# EAGLE design MD2017_Drive (EAGLE 6.2)
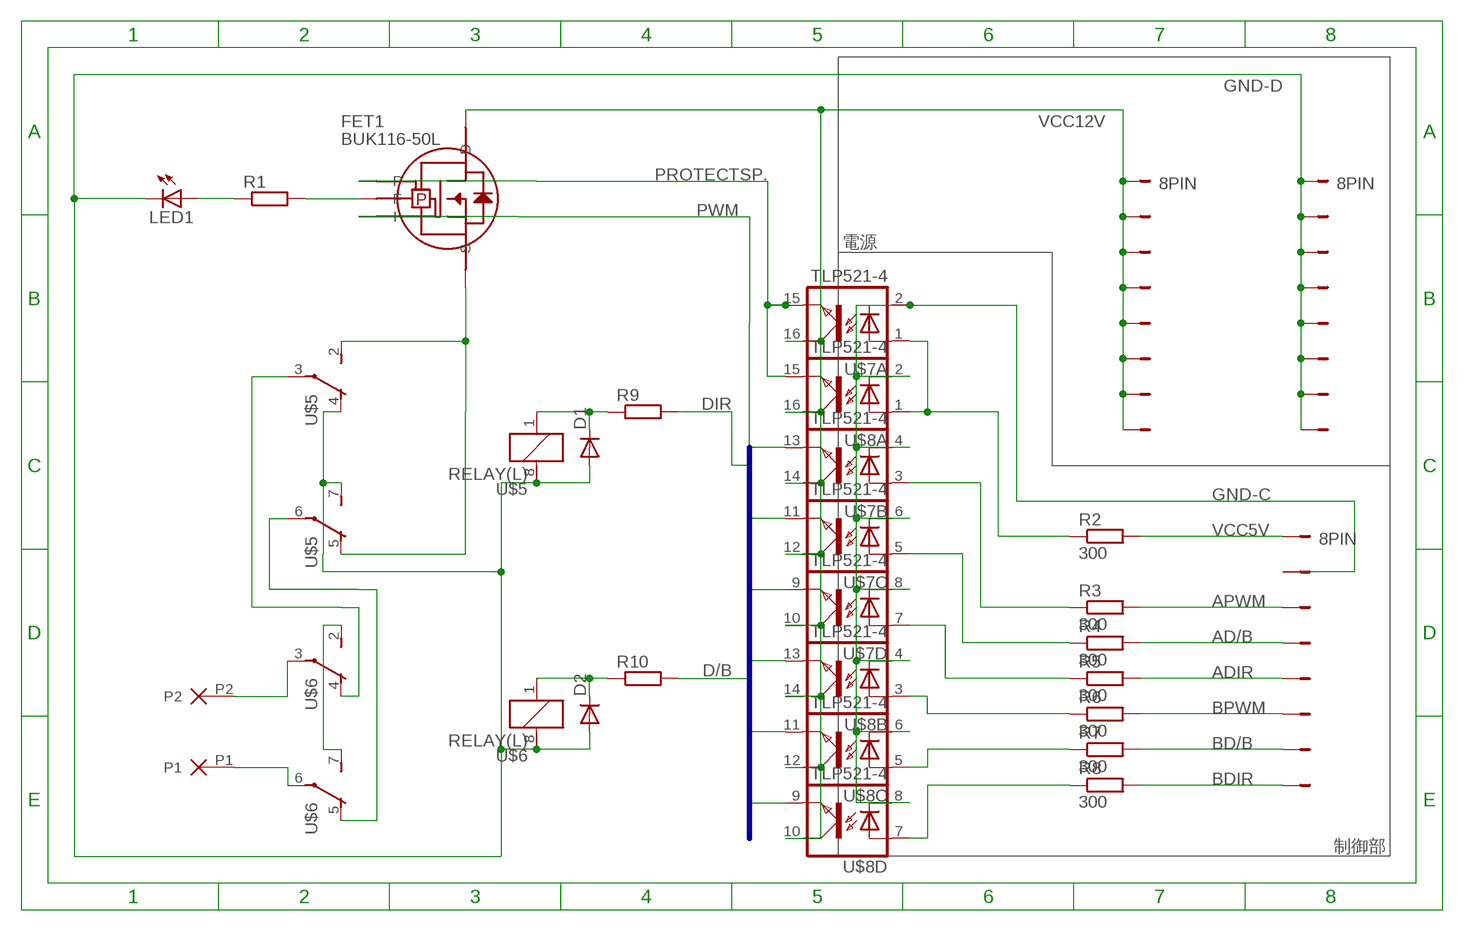
[diagram p0: schematic, sheet 1]

## Parts
D1  DIODE7.5  [DIODE7.5]
D2  DIODE7.5  [DIODE7.5]
FET1  BUK116-50L  [BUK116-50L]
LED1  LED5MM  [LED5MM]
POWERNPORT  8PIN  [FH105-1X8SG]
POWERPPORT  8PIN  [FH105-1X8SG]
R1  R-EU_R3216W  [R3216W]
R2  300  R-EU_R3216W  [R3216W]
R3  300  R-EU_R3216W  [R3216W]
R4  300  R-EU_R3216W  [R3216W]
R5  300  R-EU_R3216W  [R3216W]
R6  300  R-EU_R3216W  [R3216W]
R7  300  R-EU_R3216W  [R3216W]
R8  300  R-EU_R3216W  [R3216W]
R9  R-EU_R3216W  [R3216W]
R10  R-EU_R3216W  [R3216W]
SIGNALPORT  8PIN  [FH105-1X8SG]
U$5  RELAY(L)  [G2R2]
U$6  RELAY(L)  [G2R2]
U$7  TLP521-4  [16PIN]
U$8  TLP521-4  [16PIN]
U$9  2P  [2P]

## Nets
AD/B: R4.2 SIGNALPORT.4
ADIR: R5.2 SIGNALPORT.5
APWM: R3.2 SIGNALPORT.3
BD/B: R7.2 SIGNALPORT.7
BDIR: R8.2 SIGNALPORT.8
BPWM: R6.2 SIGNALPORT.6
BRAKES: U$6.2(R2:S) U$6.7(R1:S)
D/B: R10.2 U$7.11(C:EMIT) U$8.11(C:EMIT)
DIR: R9.2 U$7.9(D:EMIT) U$8.9(D:EMIT)
DIRN: U$5.6(R1:P) U$6.5(R1:O)
DIRP: U$5.3(R2:P) U$6.4(R2:O)
GND-C: SIGNALPORT.2 U$7.2(A:C) U$7.4(B:C) U$7.6(C:C) U$7.8(D:C) U$8.2(A:C) U$8.4(B:C) U$8.6(C:C) U$8.8(D:C)
GND-D: D1.PA(A) D2.PA(A) LED1.K(C) POWERNPORT.1 POWERNPORT.2 POWERNPORT.3 POWERNPORT.4 POWERNPORT.5 POWERNPORT.6 POWERNPORT.7 POWERNPORT.8 U$5.4(R2:O) U$5.7(R1:S) U$5.8 U$6.8
N$7: FET1.2(F) R1.2
N$8: LED1.A R1.1
NCSUPP1: R2.1 U$7.1(A:A) U$8.1(A:A)
NDSUPP1: D1.PK(C) R9.1 U$5.1
NDSUPP2: D2.PK(C) R10.1 U$6.1
NSIG1: R3.1 U$7.3(B:A)
NSIG2: R4.1 U$7.5(C:A)
NSIG3: R5.1 U$7.7(D:A)
NSIG4: R6.1 U$8.3(B:A)
NSIG5: R7.1 U$8.5(C:A)
NSIG6: R8.1 U$8.7(D:A)
OUTN: U$6.6(R1:P) U$9.P1
OUTP: U$6.3(R2:P) U$9.P2
PROTECTSP.: FET1.4(P) U$7.15(A:EMIT) U$8.15(A:EMIT)
PWM: FET1.1(I) U$7.13(B:EMIT) U$8.13(B:EMIT)
PWMOUT: FET1.5(S) U$5.2(R2:S) U$5.5(R1:O)
VCC5V: R2.2 SIGNALPORT.1
VCC12V: FET1.3(D) POWERPPORT.1 POWERPPORT.2 POWERPPORT.3 POWERPPORT.4 POWERPPORT.5 POWERPPORT.6 POWERPPORT.7 POWERPPORT.8 U$7.10(D:COL) U$7.12(C:COL) U$7.14(B:COL) U$7.16(A:COL) U$8.10(D:COL) U$8.12(C:COL) U$8.14(B:COL) U$8.16(A:COL)

## Buses
B$1

## Notes on the sheet
- 電源
- 制御部

## Library data of the parts
D1 D2 = diode:DIODE7.5
FET1 = BUK116-50L:BUK116-50L
LED1 = FP-21T for MITS:LED: LED OSRAM: - CHIPLED LG R971, LG N971, LY N971, LG Q971, LY Q971, LO R971, LY R971 LH N974, LH R974 LS Q976, LO Q976, LY Q976 LO Q996 - Hyper CHIPLED LW Q18S LB Q993, LB Q99A, LB R99A - SideLED LS A670, LO A670, LY A670, LG A670, LP A670 LB A673, LV A673, LT A673, LW A673 LH A674 LY A675 LS A676, LA A676, LO A676, LY A676, LW A676 LS A679, LY A679, LG A679 - Hyper Micro SIDELED® LS Y876, LA Y876, LO Y876, LY Y876 LT Y87S - SmartLED LW L88C, LW L88S LB L89C, LB L89S, LG L890 LS L89K, LO L89K, LY L89K LS L896, LA L896, LO L896, LY L896 - TOPLED LS T670, LO T670, LY T670, LG T670, LP T670 LSG T670, LSP T670, LSY T670, LOP T670, LYG T670 LG T671, LOG T671, LSG T671 LB T673, LV T673, LT T673, LW T673 LH T674 LS T676, LA T676, LO T676, LY T676, LB T676, LH T676, LSB T676, LW T676 LB T67C, LV T67C, LT T67C, LS T67K, LO T67K, LY T67K, LW E67C LS E67B, LA E67B, LO E67B, LY E67B, LB E67C, LV E67C, LT E67C LW T67C LS T679, LY T679, LG T679 LS T770, LO T770, LY T770, LG T770, LP T770 LB T773, LV T773, LT T773, LW T773 LH T774 LS E675, LA E675, LY E675, LS T675 LS T776, LA T776, LO T776, LY T776, LB T776 LHGB T686 LT T68C, LB T68C - Hyper Mini TOPLED® LB M676 - Mini TOPLED Santana® LG M470 LS M47K, LO M47K, LY M47K Source: http://www.osram.convergy.de - LUMILED® LXK2-PW12-R00, LXK2-PW12-S00, LXK2-PW14-U00, LXK2-PW14-V00 LXK2-PM12-R00, LXK2-PM12-S00, LXK2-PM14-U00 LXK2-PE12-Q00, LXK2-PE12-R00, LXK2-PE12-S00, LXK2-PE14-T00, LXK2-PE14-U00 LXK2-PB12-K00, LXK2-PB12-L00, LXK2-PB12-M00, LXK2-PB14-N00, LXK2-PB14-P00, LXK2-PB14-Q00 LXK2-PR12-L00, LXK2-PR12-M00, LXK2-PR14-Q00, LXK2-PR14-R00 LXK2-PD12-Q00, LXK2-PD12-R00, LXK2-PD12-S00 LXK2-PH12-R00, LXK2-PH12-S00 LXK2-PL12-P00, LXK2-PL12-Q00, LXK2-PL12-R00 Source: www.luxeon.com
POWERNPORT POWERPPORT SIGNALPORT = FH105:8PIN
R1-R10 = rcl:R-EU_: RESISTOR, European symbol
U$5 U$6 = relay:RELAY(L)
U$7 U$8 = photocoupler:TLP521-4
U$9 = Powerio:2P

## Board
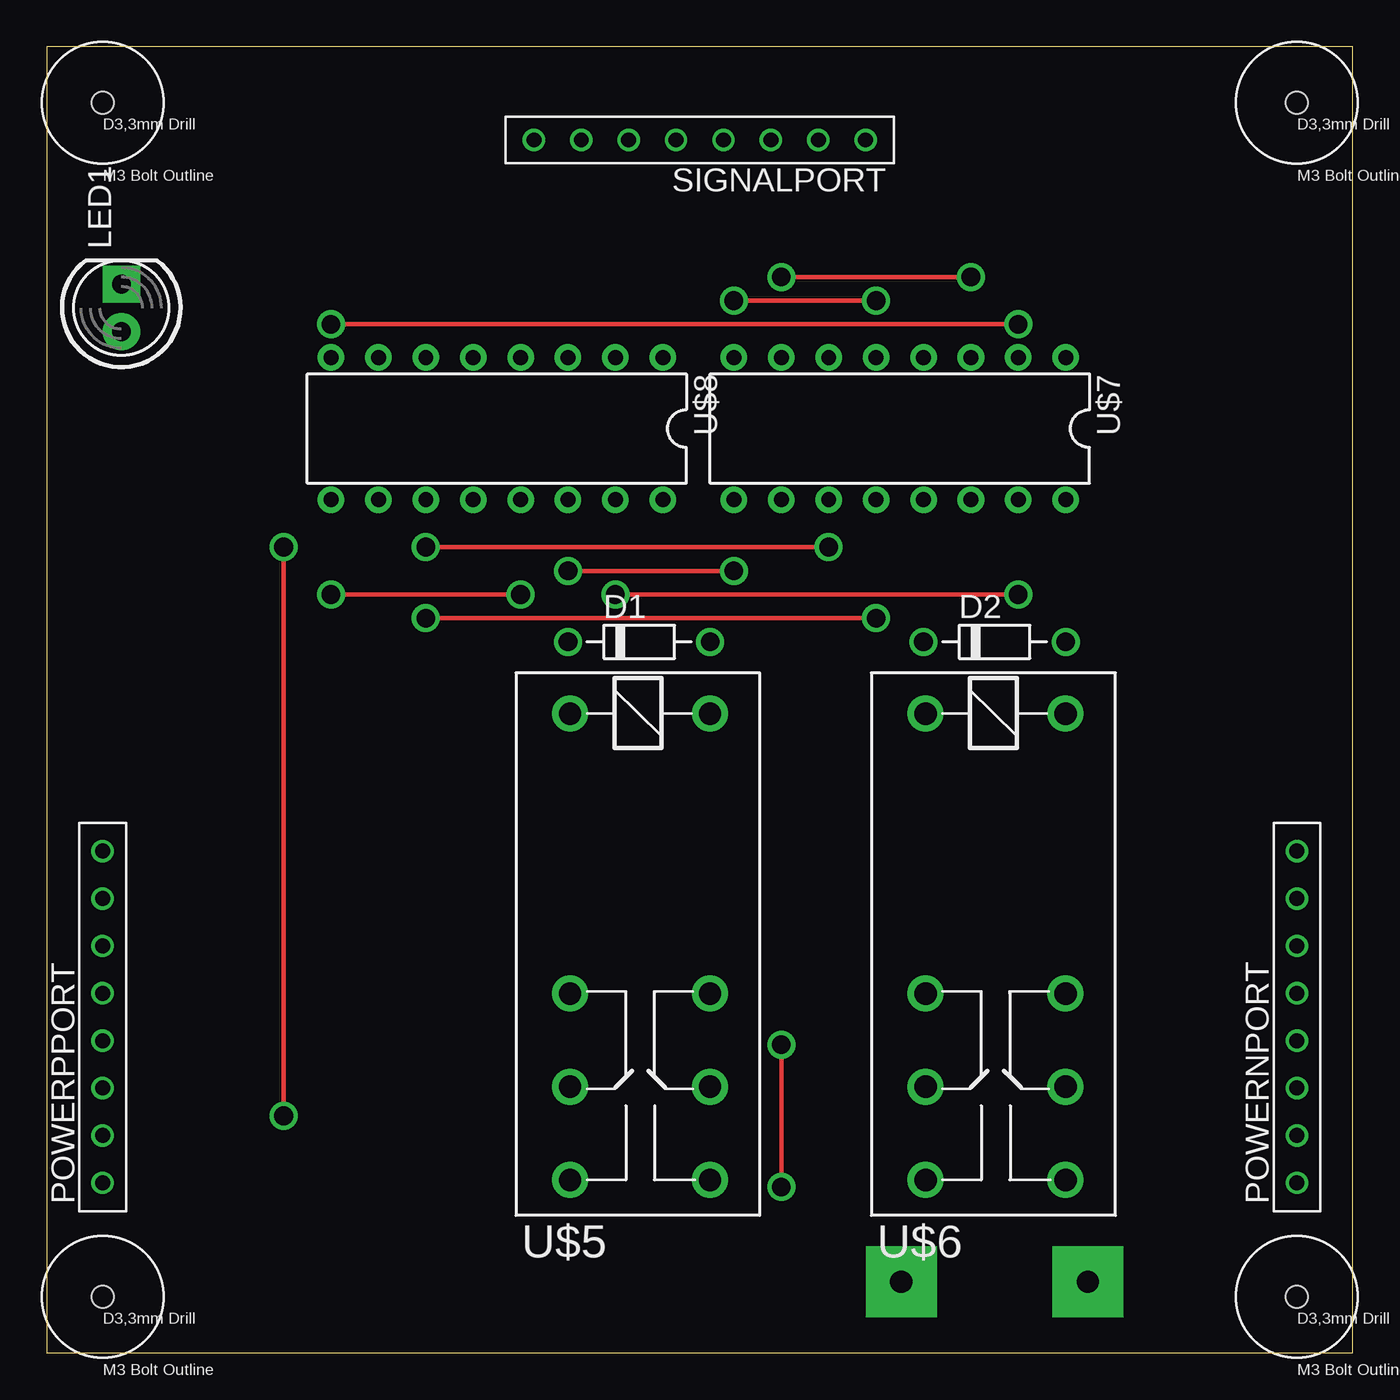
[diagram p1: board, top side]
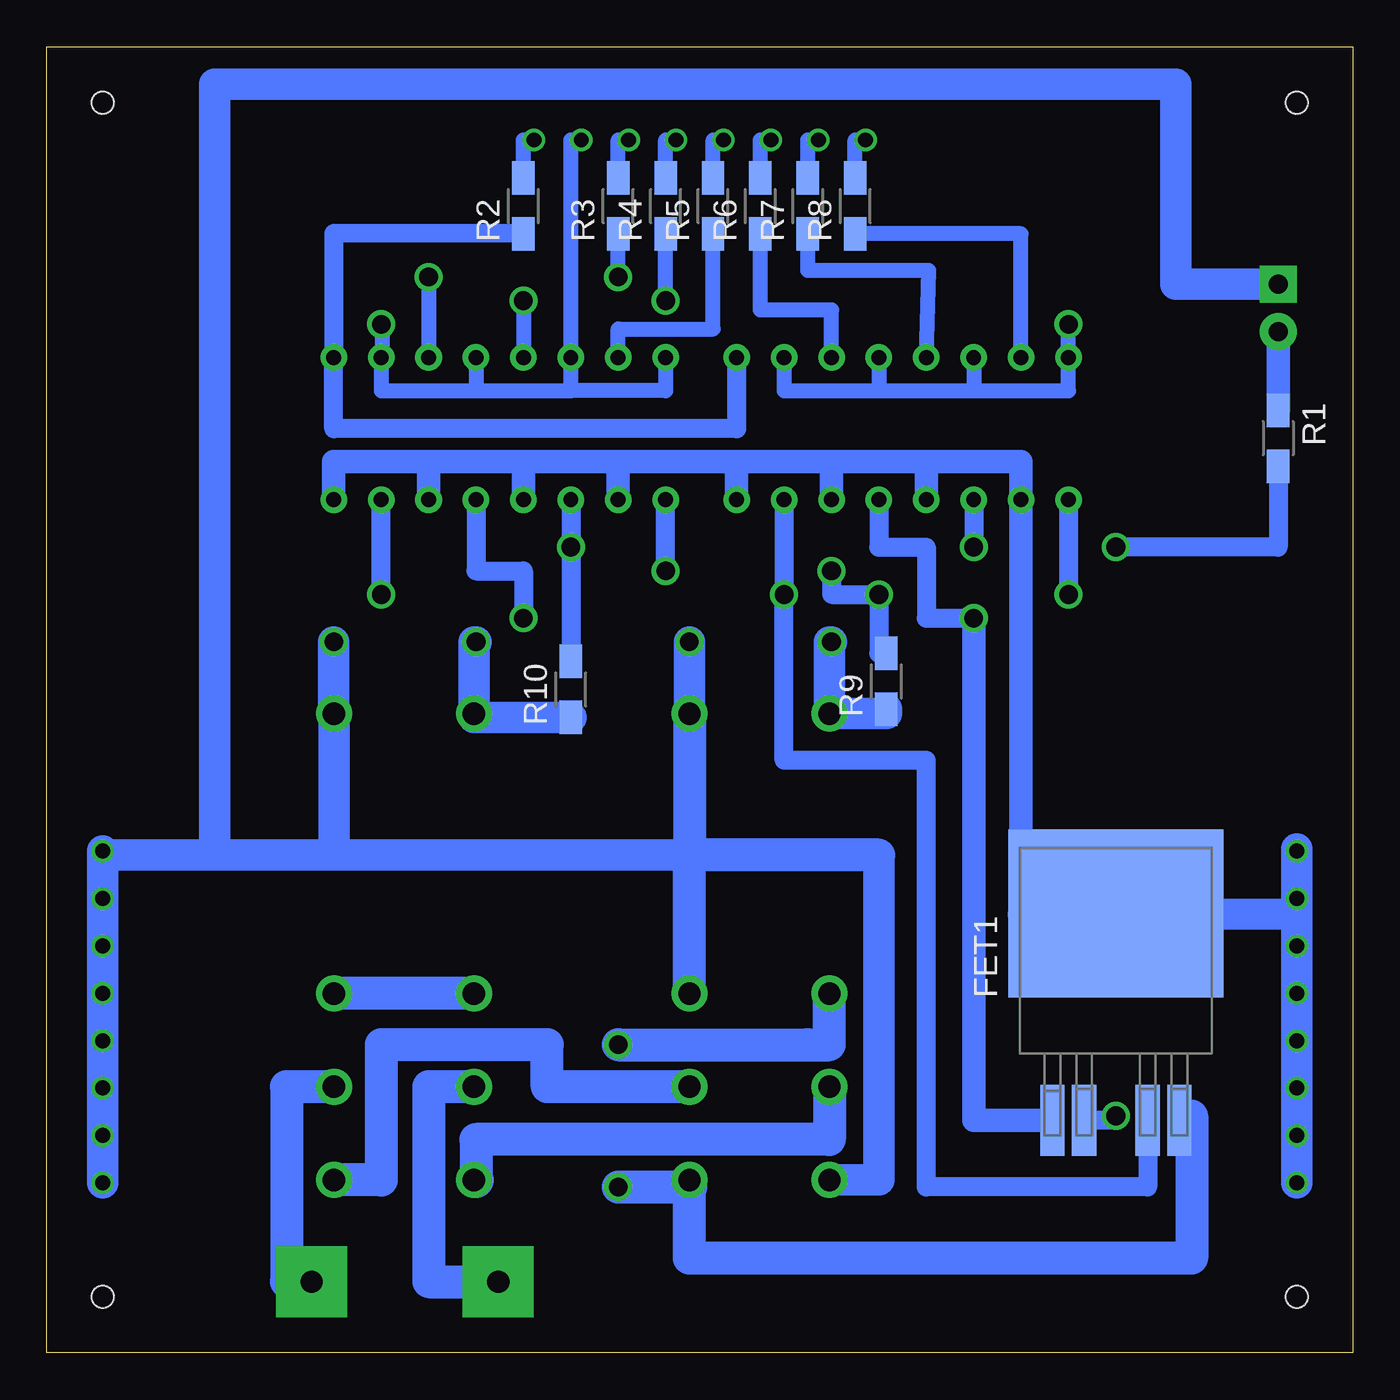
[diagram p2: board, bottom side, seen from below]

Size 70 x 70 mm. Coordinates in mm from the lower left corner, seen from the top.
Outline: 0,0 70,0 70,70 0,70 0,0
Copper layers (1*16): Top 0.035mm / dielectric 1.5mm / Bottom 0.035mm
Design rules: minimum track width 0.15mm, minimum drill 0.3mm, track to track 0.25mm, track to pad 0.25mm, pad to pad 0.25mm, via to via 0.25mm, smd to smd 0.2mm, copper to edge 0.7mm, drill to drill 0.45mm, minimum pad ring 0.15mm, minimum via ring 0.15mm, stop-mask expansion 4mil, vias tented up to drill 0mil, thermal gap 0.15mm

### Footprints (pad centres in the part's own frame; a part is rotated, then mirrored left to right if it is on the bottom)
DIODE7.5 = drill 1: PA 3.81,0; PK -3.81,0
BUK116-50L = smd 1.3 x 3.8: 1 -3.4,-6.6; 2 -1.7,-6.6; 4 1.7,-6.6; 5 3.4,-6.6 | smd 11.5 x 9: 3 0,4.5
LED5MM = drill 1 pad 2: A -1.27,0 | drill 1 pad 2 square: K 1.27,0
FH105-1X8SG = drill 0.8: 1 -8.89,0; 2 -6.35,0; 3 -3.81,0; 4 -1.27,0; 5 1.27,0; 6 3.81,0; 7 6.35,0; 8 8.89,0
R3216W = smd 1.8 x 1.2: 1 -1.499,0; 2 1.499,0
HOLE3.3 = hole 1.2: 0,0
G2R2 = drill 1.2 pad 1.93: 1 -11.4,-3.7; 2 3.6,-3.7; 3 8.6,-3.7; 4 13.6,-3.7; 5 13.6,3.8; 6 8.6,3.8; 7 3.6,3.8; 8 -11.4,3.8
16PIN = drill 0.8 pad 1.422: 1 -8.89,-3.81; 2 -6.35,-3.81; 3 -3.81,-3.81; 4 -1.27,-3.81; 5 1.27,-3.81; 6 3.81,-3.81; 7 6.35,-3.81; 8 8.89,-3.81; 9 8.89,3.81; 10 6.35,3.81; 11 3.81,3.81; 12 1.27,3.81; 13 -1.27,3.81; 14 -3.81,3.81; 15 -6.35,3.81; 16 -8.89,3.81
2P = drill 1.2 pad 3.81 square: P1 -5,0; P2 5,0

### Placement (x,y rotation side)
D1  31.75,38.1 0 top
D2  50.8,38.1 0 top
FET1  12.7,19.05 0 bottom
LED1  4,56 90 top
POWERNPORT  67,18 90 top
POWERPPORT  3,18 90 top
R1  4,49 270 bottom
R2  44.45,61.47 90 bottom
R3  39.37,61.47 90 bottom
R4  36.83,61.47 90 bottom
R5  34.29,61.47 90 bottom
R6  31.75,61.47 90 bottom
R7  29.21,61.47 90 bottom
R8  26.67,61.47 90 bottom
R9  25,36 90 bottom
R10  41.91,35.56 90 bottom
SIGNALPORT  35,65 180 top
U$1  [HOLE3.3]  3,67 0 top
U$2  [HOLE3.3]  67,67 0 top
U$3  [HOLE3.3]  3,3 0 top
U$5  31.75,22.86 270 top
U$6  50.8,22.86 270 top
U$7  45.72,49.53 180 top
U$8  24.13,49.53 180 top
U$9  50.8,3.81 180 top
U$10  [HOLE3.3]  67,3 0 top

### Tracks (layer width: path | path; a pad name or v marks a point on that pad's centre or on a via)
AD/B
  Bottom 0.813: R4.2 36.83,65 SIGNALPORT.4
ADIR
  Bottom 0.813: R5.2 34.29,65 SIGNALPORT.5
APWM
  Bottom 0.813: R3.2 39.37,65 SIGNALPORT.3
BD/B
  Bottom 0.813: R7.2 29.21,65 SIGNALPORT.7
BDIR
  Bottom 0.813: R8.2 26.67,65 SIGNALPORT.8
BPWM
  Bottom 0.813: R6.2 31.75,65 SIGNALPORT.6
BRAKES
  Bottom 1.778: U$6.2 U$6.7
D/B  (via drill 1)
  Top 0.254: v20.32,43.18 v41.91,43.18
  Bottom 1.016: U$7.11 v41.91,43.18 R10.2 | U$8.11 v20.32,43.18
DIR  (via drill 1)
  Top 0.254: v25.4,40.64 v15.24,40.64 | v27.94,41.91 v36.83,41.91
  Bottom 1.016: U$8.9 v15.24,40.64 | R9.2 25.4,37.5 v25.4,40.64 27.94,40.64 v27.94,41.91 | v36.83,41.91 U$7.9
DIRN
  Bottom 1.778: U$5.6 43.18,14.26 43.18,16.51 52.07,16.51 52.07,9.26 U$6.5
DIRP
  Bottom 1.778: U$5.3 28.05,11.43 46.99,11.43 46.99,9.26
  Bottom 1.93: 46.99,9.26 U$6.4
GND-C  (via drill 1)
  Top 0.254: v52.07,55.12 v15.24,55.12
  Bottom 0.813: U$8.6 20.32,51.56 | 20.32,51.56 15.24,51.56 U$8.8 v15.24,55.12 | U$8.4 25.4,51.56 | 25.4,51.56 20.32,51.56 | U$8.2 30.48,51.56 25.4,51.56 | SIGNALPORT.2 41.91,65 U$7.6 41.91,51.56 | U$7.8 36.83,51.56 41.91,51.56 | U$7.4 46.99,51.56 | 46.99,51.56 41.91,51.56 | 46.99,51.56 52.07,51.56 U$7.2 52.07,53.31 52,53.31 52,55.12 v52.07,55.12
GND-D
  Bottom 1.676: POWERNPORT.1 POWERNPORT.2 POWERNPORT.3 POWERNPORT.4 POWERNPORT.5 POWERNPORT.6 POWERNPORT.7 POWERNPORT.8 67,26.67 66.04,26.67 60.96,26.67 | LED1.K 9.5,57.27 9.5,57.5 9.5,68 61,68 61,26.67 60.96,26.67 | D1.PA U$5.8 | U$5.4 25.4,9.26 25.4,26.67 | 54.6,26.67 U$6.8 D2.PA | 54.6,26.67 60.96,26.67 | 35.56,26.67 54.6,26.67
  Bottom 1.778: 25.4,26.67 35.56,26.67 | U$5.8 35.55,26.67 | 35.55,26.67 35.56,26.67 | U$5.7 35.55,26.67 | 35.55,26.67 35.56,26.67
N$7  (via drill 1)
  Top 0.254: v12.7,43.18 v12.7,12.7
  Bottom 1.016: R1.2 4,43.18 v12.7,43.18 | v12.7,12.7 12.7,12.45 FET1.2
N$8
  Bottom 1.27: LED1.A R1.1
NCSUPP1
  Bottom 1.016: R2.1 54.61,60 U$7.1 54.61,49.53 33.02,49.53 U$8.1
NDSUPP1
  Bottom 1.676: D1.PK 28.05,38.1 U$5.1 25,34.26 R9.1
NDSUPP2
  Bottom 1.676: D2.PK 47.1,38.1 U$6.1 47.1,34.06 R10.1
NSIG1  (via drill 1)
  Top 0.254: v49.53,57.66 v39.37,57.66
  Bottom 0.813: v39.37,57.66 R3.1 | v49.53,57.66 U$7.3
NSIG2  (via drill 1)
  Top 0.254: v44.45,56.39 v36.83,56.39
  Bottom 0.813: v36.83,56.39 R4.1 | v44.45,56.39 U$7.5
NSIG3
  Bottom 0.813: U$7.7 39.37,54.86 34.29,54.86 R5.1
NSIG4
  Bottom 0.813: U$8.3 27.94,55.88 31.75,55.88 R6.1
NSIG5
  Bottom 0.813: U$8.5 22.73,58 29.21,58 R7.1
NSIG6
  Bottom 0.813: U$8.7 17.78,59.97 R8.1
OUTN
  Bottom 1.778: U$6.6 57.15,14.26 57.15,3.81 U$9.P1
OUTP
  Bottom 1.778: U$6.3 49.53,14.26 49.53,3.81 U$9.P2
PROTECTSP.  (via drill 1)
  Top 0.254: v52.07,40.64 v30.48,40.64
  Bottom 1.016: v52.07,40.64 U$7.15 | U$8.15 v30.48,40.64 30.48,31.75 22.86,31.75 22.86,8.89 11,8.89 FET1.4
PWM  (via drill 1)
  Top 0.254: v20.32,39.37 v44.45,39.37
  Bottom 1.016: U$7.13 46.99,41.91 44.45,41.91 v44.45,39.37 | U$8.13 25.4,43.18 22.86,43.18 22.86,39.37 v20.32,39.37
  Bottom 1.27: FET1.1 20.32,12.45 v20.32,39.37
PWMOUT  (via drill 1)
  Top 0.254: v39.37,8.89 v39.37,16.51
  Bottom 1.016: FET1.5 8.64,12.45 8.64,12.7
  Bottom 1.778: 8.64,12.7 8.64,5.08 35.55,5.08 U$5.5 | v39.37,8.89 35.55,8.89 | v39.37,16.51 29.21,16.51 28.05,16.51 U$5.2
  Bottom 1.93: 35.55,8.89 U$5.5
VCC5V
  Bottom 0.813: R2.2 44.45,65 SIGNALPORT.1
VCC12V
  Bottom 1.016: POWERPPORT.8 3,27
  Bottom 1.27: U$7.16 54.61,47.75 49.53,47.75 | 49.53,47.75 44.45,47.75 | 44.45,47.75 39.37,47.75 | 39.37,47.75 33.02,47.75 | 33.02,47.75 27.94,47.75 | 27.94,47.75 22.86,47.75 | 22.86,47.75 17.78,47.75 U$8.10 17.78,23.5 17.65,23.5 | U$8.12 22.86,47.75 | U$8.14 27.94,47.75 | U$8.16 33.02,47.75 | U$7.10 39.37,47.75 | U$7.12 44.45,47.75 | U$7.14 49.53,47.75
  Bottom 1.676: 3,27 POWERPPORT.7 | POWERPPORT.7 POWERPPORT.6 POWERPPORT.5 POWERPPORT.4 POWERPPORT.3 POWERPPORT.2 POWERPPORT.1 | POWERPPORT.7 3,23.5 FET1.3 17.65,23.5